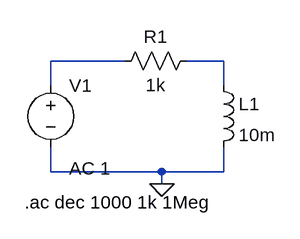
[diagram p0: schematic rl_circuit.asc]
rl_circuit.asc, the LTspice schematic file:
Version 4
SHEET 1 880 680
WIRE 192 112 96 112
WIRE 320 112 272 112
WIRE 96 144 96 112
WIRE 320 144 320 112
WIRE 96 256 96 224
WIRE 240 256 96 256
WIRE 320 256 320 224
WIRE 320 256 240 256
WIRE 240 272 240 256
FLAG 240 272 0
SYMBOL res 288 96 R90
WINDOW 0 0 56 VBottom 2
WINDOW 3 32 56 VTop 2
SYMATTR InstName R1
SYMATTR Value 1k
SYMBOL voltage 96 128 R0
WINDOW 123 24 124 Left 2
WINDOW 39 0 0 Left 0
SYMATTR InstName V1
SYMATTR Value ""
SYMATTR Value2 AC 1
SYMBOL ind 304 128 R0
SYMATTR InstName L1
SYMATTR Value 10m
TEXT 62 296 Left 2 !.ac dec 1000 1k 1Meg

The netlist it stands for:
* rl_circuit.asc
R1 N002 N001 1k
V1 N001 0 AC 1
L1 N002 0 10m
.ac dec 1000 1k 1Meg
.backanno
.end